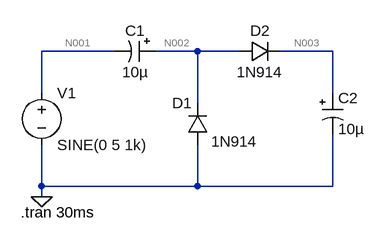
[diagram p0: schematic Draft3.asc]
Draft3.asc, the LTspice schematic file:
Version 4
SHEET 1 880 680
WIRE 192 16 80 16
WIRE 320 16 256 16
WIRE 384 16 320 16
WIRE 528 16 448 16
WIRE 80 80 80 16
WIRE 528 80 528 16
WIRE 320 96 320 16
WIRE 80 224 80 160
WIRE 320 224 320 160
WIRE 320 224 80 224
WIRE 528 224 528 144
WIRE 528 224 320 224
WIRE 80 240 80 224
FLAG 80 240 0
SYMBOL voltage 80 64 R0
WINDOW 123 0 0 Left 0
WINDOW 39 0 0 Left 0
SYMATTR InstName V1
SYMATTR Value SINE(0 5 1k)
SYMBOL polcap 256 0 R90
WINDOW 0 0 32 VBottom 2
WINDOW 3 32 32 VTop 2
SYMATTR InstName C1
SYMATTR Value 10µ
SYMATTR Description Capacitor
SYMATTR Type cap
SYMATTR SpiceLine V=6.3 Irms=0 Rser=4 Lser=0 mfg="AVX" pn="TAJA106M006" type="Tantalum"
SYMBOL diode 336 160 R180
WINDOW 0 24 64 Left 2
WINDOW 3 -76 5 Left 2
SYMATTR InstName D1
SYMATTR Value 1N914
SYMBOL diode 384 32 R270
WINDOW 0 32 32 VTop 2
WINDOW 3 0 32 VBottom 2
SYMATTR InstName D2
SYMATTR Value 1N914
SYMBOL polcap 512 80 R0
WINDOW 3 24 56 Left 2
SYMATTR Value 10µ
SYMATTR InstName C2
SYMATTR Description Capacitor
SYMATTR Type cap
SYMATTR SpiceLine V=6.3 Irms=0 Rser=4 Lser=0 mfg="AVX" pn="TAJA106M006" type="Tantalum"
TEXT 48 264 Left 2 !.tran 30ms

The netlist it stands for:
* Draft3.asc
V1 N001 0 SINE(0 5 1k)
C1 N002 N001 10µ V=6.3 Irms=0 Rser=4 Lser=0 mfg="AVX" pn="TAJA106M006" type="Tantalum"
D1 0 N002 1N914
D2 N002 N003 1N914
C2 N003 0 10µ V=6.3 Irms=0 Rser=4 Lser=0 mfg="AVX" pn="TAJA106M006" type="Tantalum"
.model D D
.lib standard.dio
.tran 30ms
.backanno
.end

* Results of the author's LTspice run, read from the files saved beside the schematic
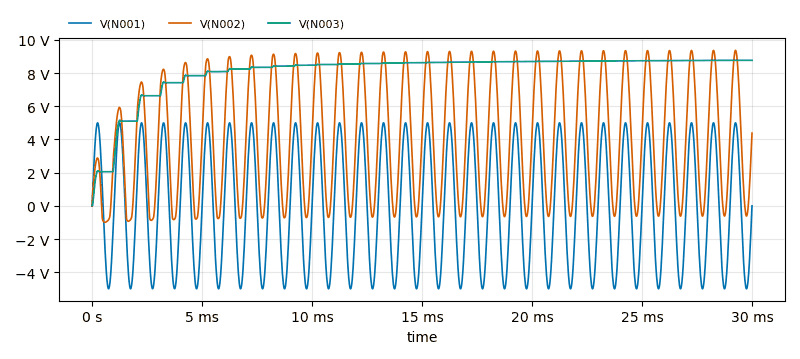
[diagram p1: Transient Analysis of Draft3.asc, plotted from the saved traces]
* Transient Analysis, 1 run:
*   V(N001): min -5 V, max 5 V, average -116.2 µV, rms 3.54 V, last 0 V
*   V(N002): min -992.2 mV, max 9.365 V, average 4.042 V, rms 5.348 V, last 4.379 V
*   V(N003): min 0 V, max 8.768 V, average 8.104 V, rms 8.228 V, last 8.766 V